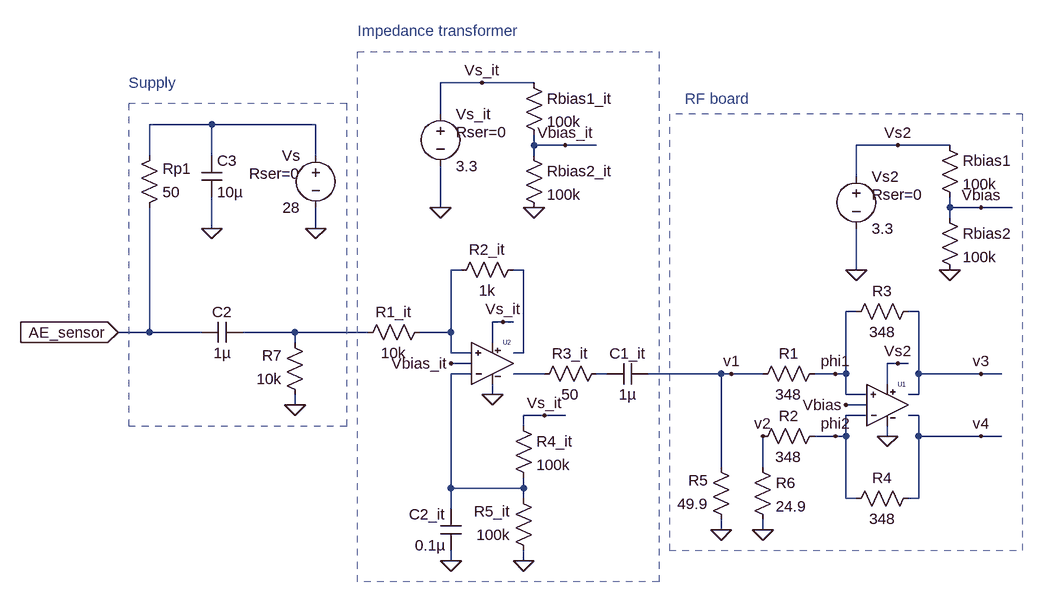
[diagram p0: schematic AE VS375-RIC - opamp.asc]
AE VS375-RIC - opamp.asc, the LTspice schematic file:
Version 4
SHEET 1 1940 680
WIRE 1104 -384 1040 -384
WIRE 1184 -384 1104 -384
WIRE 1040 -336 1040 -384
WIRE 688 -320 592 -320
WIRE 848 -320 688 -320
WIRE 1184 -288 1184 -304
WIRE 1232 -288 1184 -288
WIRE 1280 -288 1232 -288
WIRE 1744 -288 1680 -288
WIRE 1824 -288 1744 -288
WIRE 592 -272 592 -320
WIRE 688 -272 688 -320
WIRE 848 -272 848 -320
WIRE 1184 -272 1184 -288
WIRE 1680 -240 1680 -288
WIRE 1040 -192 1040 -256
WIRE 1824 -192 1824 -208
WIRE 1872 -192 1824 -192
WIRE 1920 -192 1872 -192
WIRE 1824 -176 1824 -192
WIRE 688 -160 688 -208
WIRE 848 -160 848 -192
WIRE 1072 -96 1056 -96
WIRE 1168 -96 1152 -96
WIRE 1680 -96 1680 -160
WIRE 1680 -32 1664 -32
WIRE 1776 -32 1760 -32
WIRE 1136 -16 1120 -16
WIRE 1152 -16 1136 -16
WIRE 592 0 592 -192
WIRE 592 0 544 0
WIRE 672 0 592 0
WIRE 816 0 736 0
WIRE 928 0 816 0
WIRE 1056 0 1056 -96
WIRE 1056 0 1008 0
WIRE 816 16 816 0
WIRE 1120 16 1120 -16
WIRE 1056 32 1056 0
WIRE 1088 32 1056 32
WIRE 1168 32 1168 -96
WIRE 1168 32 1152 32
WIRE 1088 48 1056 48
WIRE 1744 48 1728 48
WIRE 1760 48 1744 48
WIRE 1088 64 1056 64
WIRE 1200 64 1152 64
WIRE 1296 64 1280 64
WIRE 1472 64 1360 64
WIRE 1488 64 1472 64
WIRE 1536 64 1488 64
WIRE 1648 64 1616 64
WIRE 1664 64 1664 -32
WIRE 1664 64 1648 64
WIRE 1776 64 1776 -32
WIRE 1872 64 1776 64
WIRE 1904 64 1872 64
WIRE 1728 80 1728 48
WIRE 1120 96 1120 80
WIRE 1664 96 1664 64
WIRE 1696 96 1664 96
WIRE 1776 96 1776 64
WIRE 1776 96 1760 96
WIRE 816 112 816 96
WIRE 1696 112 1664 112
WIRE 1200 128 1168 128
WIRE 1232 128 1200 128
WIRE 1696 128 1664 128
WIRE 1776 128 1760 128
WIRE 1168 144 1168 128
WIRE 1648 160 1616 160
WIRE 1664 160 1664 128
WIRE 1664 160 1648 160
WIRE 1728 160 1728 144
WIRE 1776 160 1776 128
WIRE 1872 160 1776 160
WIRE 1904 160 1872 160
WIRE 1472 208 1472 64
WIRE 1536 208 1536 160
WIRE 1056 240 1056 64
WIRE 1168 240 1168 224
WIRE 1168 240 1056 240
WIRE 1168 256 1168 240
WIRE 1664 256 1664 160
WIRE 1680 256 1664 256
WIRE 1776 256 1776 160
WIRE 1776 256 1760 256
WIRE 1056 272 1056 240
WIRE 1472 304 1472 288
WIRE 1536 304 1536 288
WIRE 1056 352 1056 336
WIRE 1168 352 1168 336
FLAG 1472 304 0
FLAG 1536 304 0
FLAG 848 -160 0
FLAG 688 -160 0
FLAG 1488 64 v1
FLAG 1536 160 v2
FLAG 1728 160 0
FLAG 1680 -96 0
FLAG 1744 -288 Vs2
FLAG 1744 48 Vs2
FLAG 1872 64 v3
FLAG 1872 160 v4
FLAG 1664 112 Vbias
FLAG 1824 -96 0
FLAG 1872 -192 Vbias
FLAG 1648 64 phi1
FLAG 1648 160 phi2
FLAG 544 0 AE_sensor
IOPIN 544 0 In
FLAG 1168 352 0
FLAG 1056 352 0
FLAG 1120 96 0
FLAG 1056 48 Vbias_it
FLAG 1200 128 Vs_it
FLAG 1040 -192 0
FLAG 1104 -384 Vs_it
FLAG 1184 -192 0
FLAG 1232 -288 Vbias_it
FLAG 1136 -16 Vs_it
FLAG 816 112 0
SYMBOL res 576 -176 M180
WINDOW 0 36 76 Left 2
WINDOW 3 36 40 Left 2
SYMATTR InstName Rp1
SYMATTR Value 50
SYMATTR SpiceLine ""
SYMBOL res 1488 304 R180
WINDOW 0 36 76 Left 2
WINDOW 3 36 40 Left 2
SYMATTR InstName R5
SYMATTR Value 49.9
SYMATTR SpiceLine ""
SYMBOL res 1520 80 R270
WINDOW 0 32 56 VTop 2
WINDOW 3 0 56 VBottom 2
SYMATTR InstName R1
SYMATTR Value 348
SYMATTR SpiceLine ""
SYMBOL res 1520 192 R0
SYMATTR InstName R6
SYMATTR Value 24.9
SYMATTR SpiceLine ""
SYMBOL res 1632 144 R90
WINDOW 0 0 56 VBottom 2
WINDOW 3 32 56 VTop 2
SYMATTR InstName R2
SYMATTR Value 348
SYMATTR SpiceLine ""
SYMBOL res 1776 -48 R90
WINDOW 0 0 56 VBottom 2
WINDOW 3 32 56 VTop 2
SYMATTR InstName R3
SYMATTR Value 348
SYMATTR SpiceLine ""
SYMBOL res 1776 240 R90
WINDOW 0 0 56 VBottom 2
WINDOW 3 32 56 VTop 2
SYMATTR InstName R4
SYMATTR Value 348
SYMATTR SpiceLine ""
SYMBOL cap 736 -16 R90
WINDOW 0 0 32 VBottom 2
WINDOW 3 32 32 VTop 2
SYMATTR InstName C2
SYMATTR Value 1µ
SYMATTR SpiceLine ""
SYMBOL cap 672 -208 M180
WINDOW 0 24 56 Left 2
WINDOW 3 24 8 Left 2
SYMATTR InstName C3
SYMATTR Value 10µ
SYMATTR SpiceLine ""
SYMBOL voltage 848 -288 M0
WINDOW 123 0 0 Left 2
WINDOW 39 24 44 Left 2
SYMATTR Value2 ""
SYMATTR SpiceLine Rser=0
SYMATTR InstName Vs
SYMATTR Value 28
SYMBOL ad8132 1728 112 R0
SYMATTR InstName U1
SYMBOL voltage 1680 -256 R0
WINDOW 123 0 0 Left 2
WINDOW 39 24 44 Left 2
SYMATTR Value2 ""
SYMATTR SpiceLine Rser=0
SYMATTR InstName Vs2
SYMATTR Value 3.3
SYMBOL res 1808 -192 R0
SYMATTR InstName Rbias2
SYMATTR Value 100k
SYMATTR SpiceLine ""
SYMBOL res 1808 -304 R0
SYMATTR InstName Rbias1
SYMATTR Value 100k
SYMATTR SpiceLine ""
SYMBOL ad8132 1120 48 R0
SYMATTR InstName U2
SYMBOL res 912 16 R270
WINDOW 0 32 56 VTop 2
WINDOW 3 0 56 VBottom 2
SYMATTR InstName R1_it
SYMATTR Value 10k
SYMBOL res 1056 -80 R270
WINDOW 0 32 56 VTop 2
WINDOW 3 0 56 VBottom 2
SYMATTR InstName R2_it
SYMATTR Value 1k
SYMBOL res 1184 352 R180
WINDOW 0 36 76 Left 2
WINDOW 3 36 40 Left 2
SYMATTR InstName R5_it
SYMATTR Value 100k
SYMBOL res 1152 128 R0
SYMATTR InstName R4_it
SYMATTR Value 100k
SYMBOL res 1184 80 R270
WINDOW 0 32 56 VTop 2
WINDOW 3 0 56 VBottom 2
SYMATTR InstName R3_it
SYMATTR Value 50
SYMBOL cap 1360 48 R90
WINDOW 0 0 32 VBottom 2
WINDOW 3 32 32 VTop 2
SYMATTR InstName C1_it
SYMATTR Value 1µ
SYMATTR SpiceLine ""
SYMBOL cap 1072 336 R180
WINDOW 0 24 56 Left 2
WINDOW 3 24 8 Left 2
SYMATTR InstName C2_it
SYMATTR Value 0.1µ
SYMATTR SpiceLine ""
SYMBOL voltage 1040 -352 R0
WINDOW 123 0 0 Left 2
WINDOW 39 24 44 Left 2
SYMATTR Value2 ""
SYMATTR SpiceLine Rser=0
SYMATTR InstName Vs_it
SYMATTR Value 3.3
SYMBOL res 1168 -288 R0
SYMATTR InstName Rbias2_it
SYMATTR Value 100k
SYMATTR SpiceLine ""
SYMBOL res 1168 -400 R0
SYMATTR InstName Rbias1_it
SYMATTR Value 100k
SYMATTR SpiceLine ""
SYMBOL res 832 112 R180
WINDOW 0 36 76 Left 2
WINDOW 3 36 40 Left 2
SYMATTR InstName R7
SYMATTR Value 10k
SYMATTR SpiceLine ""
TEXT 1416 -360 Left 2 ;RF board
TEXT 912 -464 Left 2 ;Impedance transformer
TEXT 560 -384 Left 2 ;Supply
RECTANGLE Normal 1376 384 912 -432 2
RECTANGLE Normal 1392 336 1936 -336 2
RECTANGLE Normal 560 144 896 -352 2

The netlist it stands for:
* AE VS375-RIC - opamp.asc
Rp1 AE_sensor N001 50
R5 0 v1 49.9
R1 v1 phi1 348
R6 v2 0 24.9
R2 phi2 v2 348
R3 v3 phi1 348
R4 v4 phi2 348
C2 N004 AE_sensor 1µ
C3 0 N001 10µ
Vs N001 0 28 Rser=0
XU1 phi1 phi2 Vs2 0 v3 v4 Vbias AD8132  ; pins In+ In- V+ V- OUT- OUT+ VOCM
Vs2 Vs2 0 3.3 Rser=0
Rbias2 Vbias 0 100k
Rbias1 Vs2 Vbias 100k
XU2 N002 N005 Vs_it 0 N003 N006 Vbias_it AD8132  ; pins In+ In- V+ V- OUT- OUT+ VOCM
R1_it N004 N002 10k
R2_it N002 N003 1k
R5_it 0 N005 100k
R4_it Vs_it N005 100k
R3_it N006 N007 50
C1_it v1 N007 1µ
C2_it 0 N005 0.1µ
Vs_it Vs_it 0 3.3 Rser=0
Rbias2_it Vbias_it 0 100k
Rbias1_it Vs_it Vbias_it 100k
R7 0 N004 10k
* RF board
* Impedance transformer
* Supply
.lib ad8132.cir
.backanno
.end